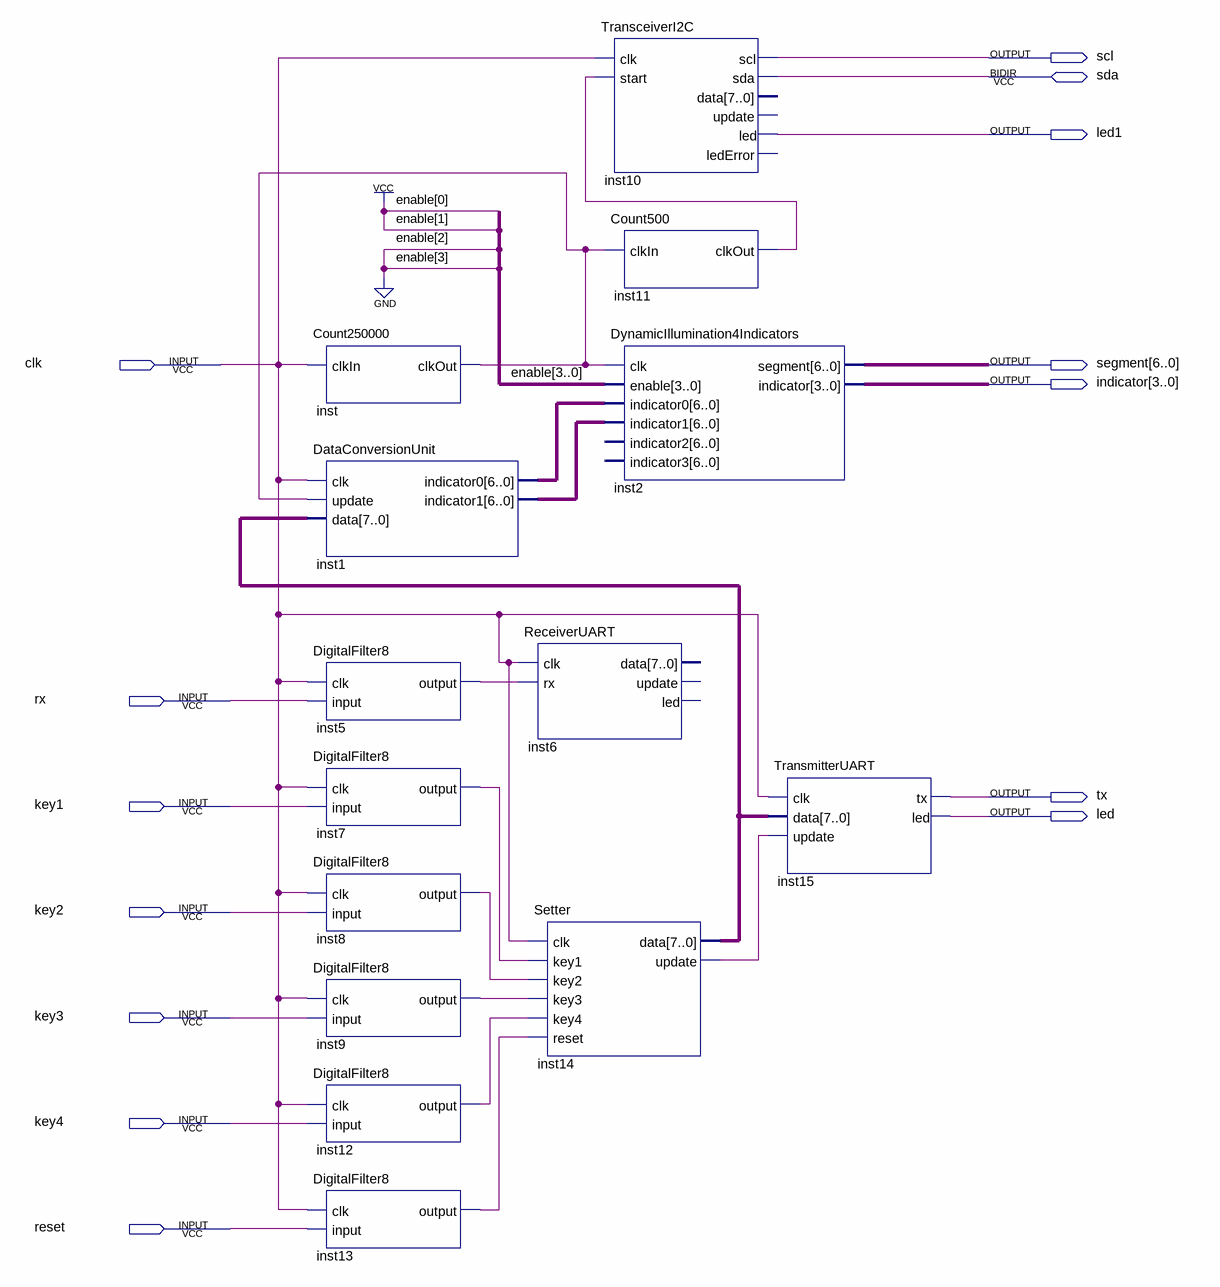
[diagram p0: schematic sheet]
// Quartus schematic VHDLstart03.bdf as structural Verilog: 14 symbols, 14 pins
module VHDLstart03 (
  input  clk,
  input  rx,
  input  key1,
  input  key2,
  input  key3,
  input  key4,
  input  reset,
  inout  sda,
  output scl,
  output led1,
  output [6:0] segment,
  output [3:0] indicator,
  output tx,
  output led
);

  wire inst5_output, inst7_output, inst8_output, inst9_output, inst11_clkout, inst12_output, inst13_output,
       inst14_update, inst_clkout;
  wire [6:0] inst1_indicator0, inst1_indicator1;
  wire [7:0] inst14_data;

  Count250000 inst (.clkIn(clk), .clkOut(inst_clkout));
  DataConversionUnit inst1 (
    .clk(clk), .update(inst_clkout), .data(inst14_data), .indicator0(inst1_indicator0),
    .indicator1(inst1_indicator1));
  DigitalFilter8 inst5 (.clk(clk), .\input (rx), .\output (inst5_output));
  DigitalFilter8 inst7 (.clk(clk), .\input (key1), .\output (inst7_output));
  DigitalFilter8 inst8 (.clk(clk), .\input (key2), .\output (inst8_output));
  DigitalFilter8 inst9 (.clk(clk), .\input (key3), .\output (inst9_output));
  DigitalFilter8 inst12 (.clk(clk), .\input (key4), .\output (inst12_output));
  DigitalFilter8 inst13 (.clk(clk), .\input (reset), .\output (inst13_output));
  ReceiverUART inst6 (.clk(clk), .rx(inst5_output));  // open: data, update, led
  Setter inst14 (
    .clk(clk), .key1(inst7_output), .key2(inst8_output), .key3(inst9_output), .key4(inst12_output),
    .reset(inst13_output), .data(inst14_data), .update(inst14_update));
  TransceiverI2C inst10 (
    .clk(clk), .start(inst11_clkout), .scl(scl), .led(led1), .sda(sda));  // open: data, update, ledError
  Count500 inst11 (.clkIn(inst_clkout), .clkOut(inst11_clkout));
  DynamicIllumination4Indicators inst2 (
    .clk(inst_clkout), .enable(4'b0011), .indicator0(inst1_indicator0), .indicator1(inst1_indicator1),
    .segment(segment), .indicator(indicator));  // open: indicator2, indicator3
  TransmitterUART inst15 (.clk(clk), .data(inst14_data), .update(inst14_update), .tx(tx), .led(led));
endmodule
